# EAGLE schematic IR sensor new v2 (EAGLE 9.7.0)
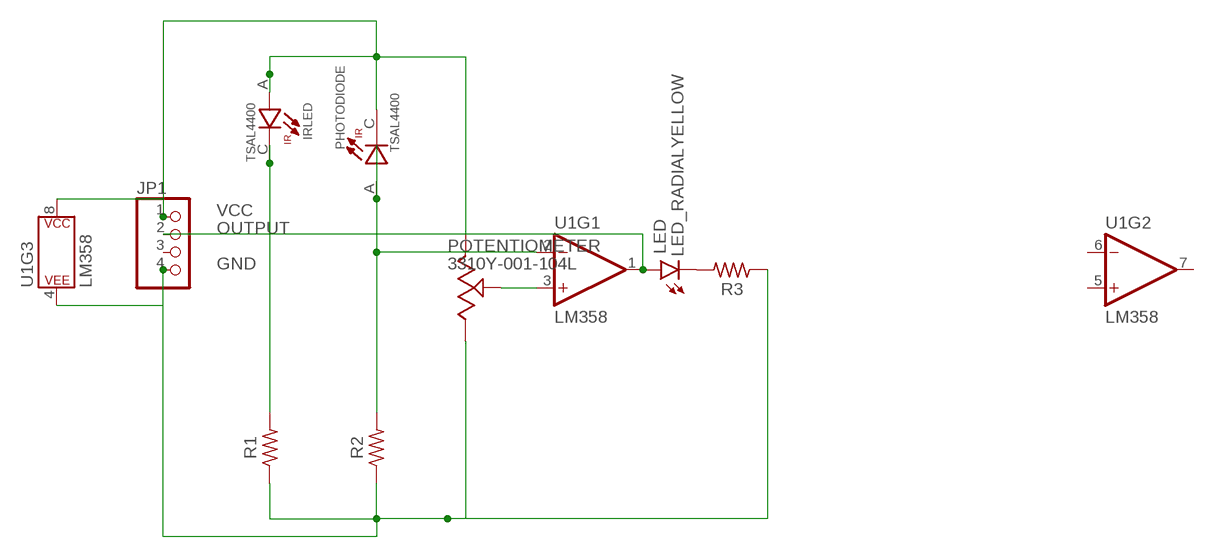
[diagram p0: schematic, sheet 1]

## Parts
IRLED  TSAL4400  [LEDRD254W45D335H610]
JP1  PINHD-1X4/90  [1X04/90]
LED  LED_RADIALYELLOW  [LEDRD254W60D565H860B_Y]
PHOTODIODE  TSAL4400  [LEDRD254W45D335H610]
POTENTIOMETER  3310Y-001-104L  [3310Y-001-104L-ND]
R1  R-US_AXIAL-7.2MM-PITCH  [RESAD724W46L381D178B]
R2  R-US_AXIAL-7.2MM-PITCH  [RESAD724W46L381D178B]
R3  R-US_AXIAL-7.2MM-PITCH  [RESAD724W46L381D178B]
U1  LM358  LM358KIT  [DIP08-KIT]

## Nets
GND: JP1.4 POTENTIOMETER.3 R1.1 R2.1 R3.1 U1.4(P$V-)
N$1: IRLED.C R1.2
N$3: PHOTODIODE.A R2.2 U1.2(-IN)
N$4: LED.C R3.2
N$5: POTENTIOMETER.2 U1.3(+IN)
OUTPUT: JP1.2 LED.A U1.1(OUT)
VCC: IRLED.A JP1.1 PHOTODIODE.C POTENTIOMETER.1 U1.8(P$V+)
Unconnected: JP1.3 U1.5(+IN) U1.6(-IN) U1.7(OUT)

## Library data of the parts
IRLED PHOTODIODE = TSAL4400(IR LED):TSAL4400: Infrared Emitter: 940nm, 36mW/sr, +/-25degrees Check availability <https://pricing.snapeda.com/parts/TSAL4400/Vishay%20Semiconductor/view-part?ref=eda>; AVAILABILITY: In Stock; CHECK_PRICES: https://www.snapeda.com/parts/TSAL4400/Vishay+Semiconductor+Opto+Division/view-part/?ref=eda; DESCRIPTION: Infrared (IR) Emitter 940nm 1.35V 100mA 16mW/sr @ 100mA 50° Radial, 3mm Dia (T-1); MF: Vishay Semiconductor; MP: TSAL4400; PACKAGE: Radial Vishay; PRICE: None; PURCHASE-URL: https://www.snapeda.com/api/url_track_click_mouser/?unipart_id=231007&manufacturer=Vishay Semiconductor&part_name=TSAL4400&search_term=through hole ir led; SNAPEDA_LINK: https://www.snapeda.com/parts/TSAL4400/Vishay+Semiconductor+Opto+Division/view-part/?ref=snap
JP1 = AtoZlibrary:PINHD-1X4: PIN HEADER
LED = Opto-Electronic:LED_RADIAL: LED - Generic
POTENTIOMETER = Potentiometer_Trimmers:3310Y-001-104L: POT 100K OHM 1/4W PLASTIC LINEAR Manufacturer's datasheet <https://www.bourns.com/docs/Product-Datasheets/3310.pdf>; CREATED_BY: PCBLayout.com; DIGIKEY_PARTNO: 3310Y-001-104L-ND; MANUFACTURER: Bourns Inc.; MPN: 3310Y-001-104L
R1-R3 = Resistor:R-US: Resistor Fixed - ANSI; CATEGORY: Resistor; SUB-CATEGORY: Fixed
U1 = SparkFun-IC-Amplifiers:LM358: LM358 Jellybean op-amp Datasheet <http://www.sparkfun.com/datasheets/Components/General/LM358.pdf> SparkFun Products Op-Amp (Thru-Hole) - LM358 <https://www.sparkfun.com/products/9456> (COM-09456); PROD_ID: IC-09172